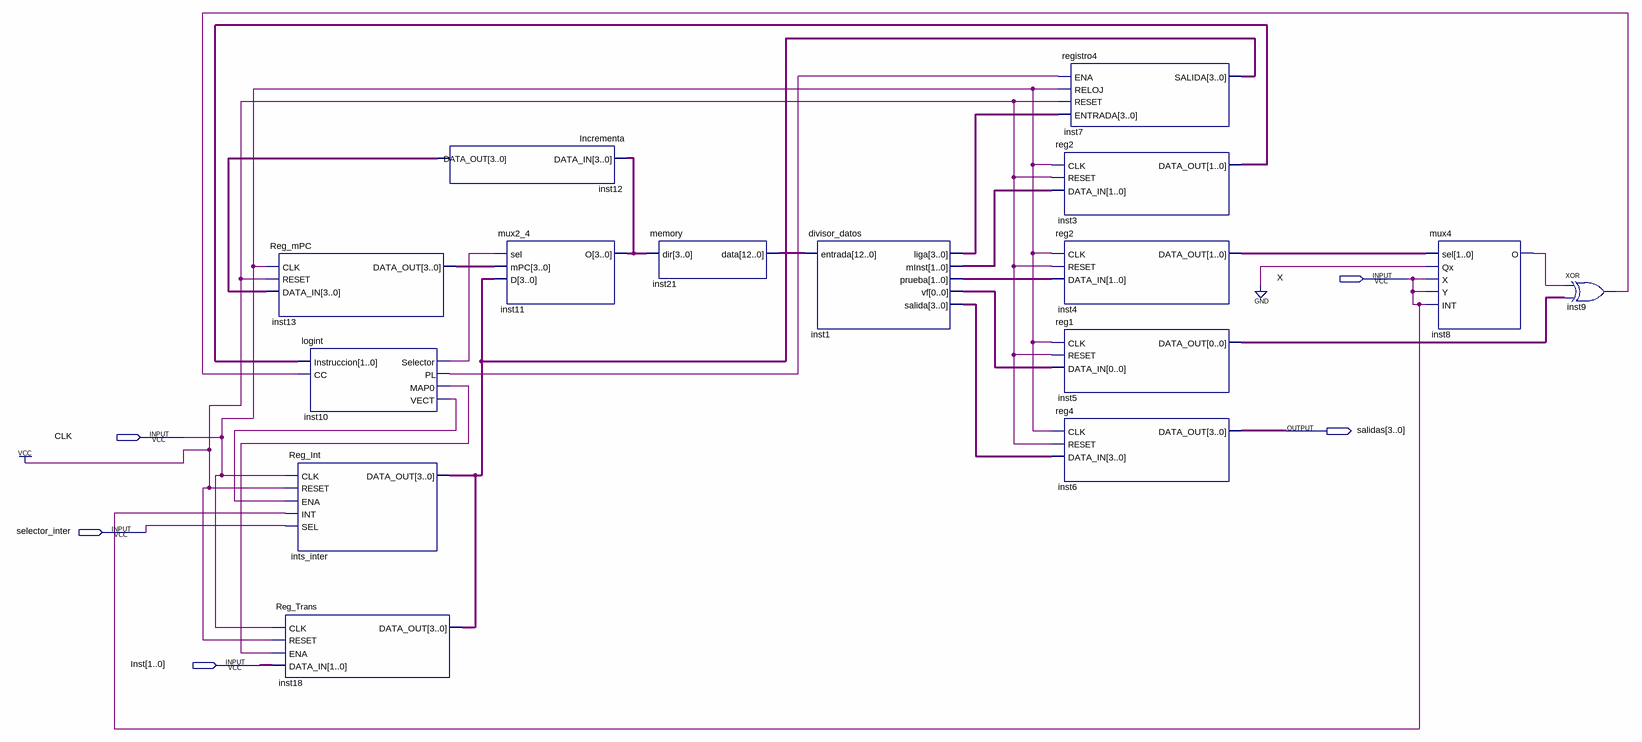
[diagram p0: schematic sheet]
// Quartus schematic p4.bdf as structural Verilog: 15 symbols, 5 pins
module p4 (
  input  X,
  input  CLK,
  input  selector_inter,
  input  [1:0] Inst,
  output [3:0] salidas
);

  wire inst1_vf, inst5_data_out, inst8_o, inst9_out, inst10_map0, inst10_pl, inst10_selector, inst10_vect;
  wire [1:0] inst1_minst, inst1_prueba, inst3_data_out, inst4_data_out;
  wire [3:0] inst1_liga, inst1_salida, inst11_o, inst12_data_out, inst13_data_out, inst18_data_out;
  wire [12:0] inst21_data;

  Reg_mPC inst13 (.CLK(CLK), .RESET(1'b1), .DATA_IN(inst12_data_out), .DATA_OUT(inst13_data_out));
  Reg_Trans inst18 (.CLK(CLK), .RESET(1'b1), .ENA(inst10_map0), .DATA_IN(Inst), .DATA_OUT(inst18_data_out));
  logint inst10 (
    .Instruccion(inst3_data_out), .CC(inst9_out), .Selector(inst10_selector), .PL(inst10_pl),
    .MAP0(inst10_map0), .VECT(inst10_vect));
  Reg_Int ints_inter (
    .CLK(CLK), .RESET(1'b1), .ENA(inst10_vect), .INT(X), .SEL(selector_inter), .DATA_OUT(inst18_data_out));
  Incrementa inst12 (.DATA_IN(inst11_o), .DATA_OUT(inst12_data_out));
  mux2_4 inst11 (.sel(inst10_selector), .mPC(inst13_data_out), .D(inst18_data_out), .O(inst11_o));
  memory inst21 (.dir(inst11_o), .data(inst21_data));
  divisor_datos inst1 (
    .entrada(inst21_data), .liga(inst1_liga), .mInst(inst1_minst), .prueba(inst1_prueba), .vf(inst1_vf),
    .salida(inst1_salida));
  registro4 inst7 (.ENA(inst10_pl), .RELOJ(CLK), .RESET(1'b1), .ENTRADA(inst1_liga), .SALIDA(inst18_data_out));
  reg2 inst3 (.CLK(CLK), .RESET(1'b1), .DATA_IN(inst1_minst), .DATA_OUT(inst3_data_out));
  reg2 inst4 (.CLK(CLK), .RESET(1'b1), .DATA_IN(inst1_prueba), .DATA_OUT(inst4_data_out));
  reg1 inst5 (.CLK(CLK), .RESET(1'b1), .DATA_IN(inst1_vf), .DATA_OUT(inst5_data_out));
  reg4 inst6 (.CLK(CLK), .RESET(1'b1), .DATA_IN(inst1_salida), .DATA_OUT(salidas));
  mux4 inst8 (.sel(inst4_data_out), .Qx(1'b0), .X(X), .Y(X), .INT(X), .O(inst8_o));
  xor inst9 (inst9_out, inst8_o, inst5_data_out);
endmodule
